# Altium project RSL10.PrjPcb
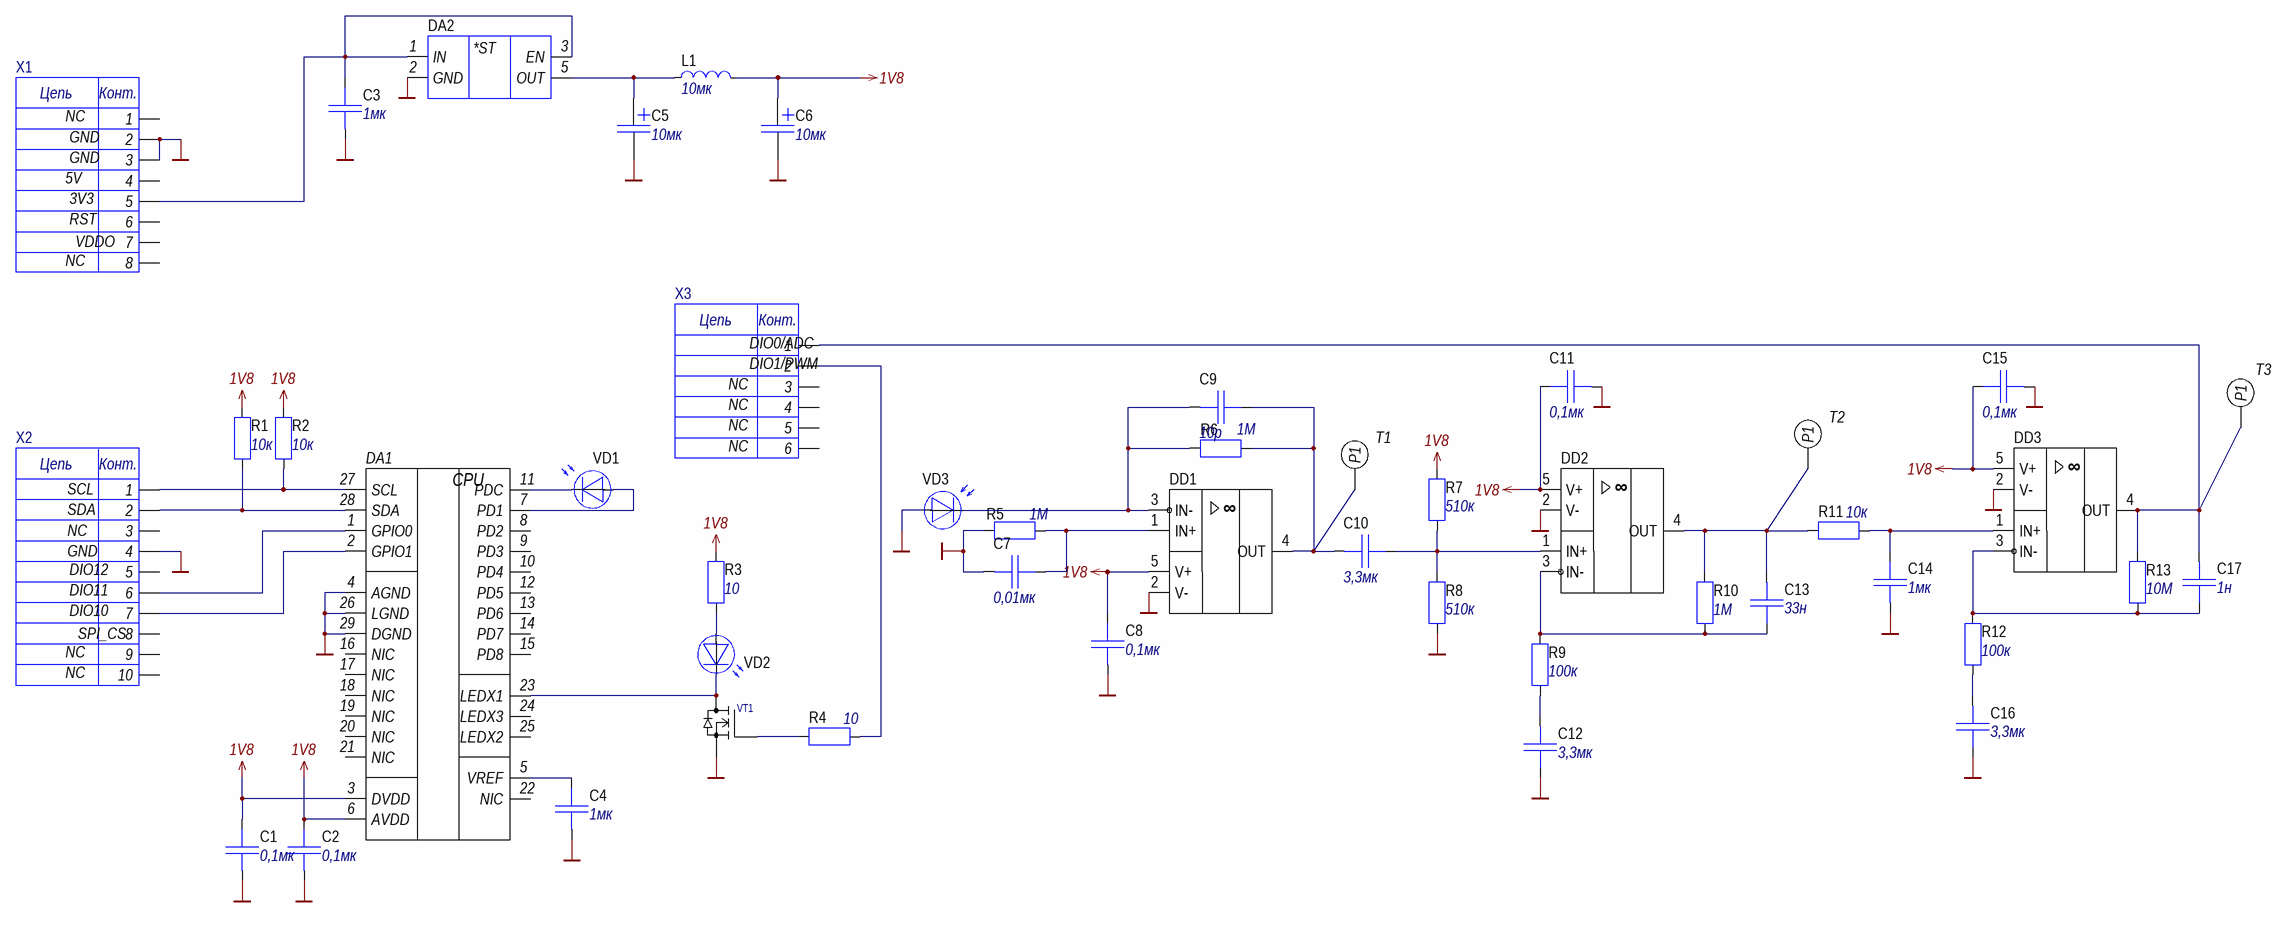
[diagram p0: RSL10_Sch.SchDoc]
2 sheets, 113 parts. Net scope: global (net labels, ports and power ports of the same name join across sheets).
Board file: RSL10_PCB.PcbDoc
Sheets:
  RSL10_Sch.SchDoc
  Course.SchDoc

## Sheet RSL10_Sch.SchDoc
size 594 x 420 mm; CheckedBy: Нестеренко И.В.; Author: Митр Д.В.; SheetNumber: 1; SheetTotal: 2; DevelopedBy: Митр Д.В.

### Parts
C1  0,1мк  [cap0603]
C2  0,1мк  [cap0603]
C3  1мк  [cap0603]
C4  1мк  [cap0603]
C5  10мк
C6  10мк
C7  0,01мк  [cap0603]
C8  0,1мк  [cap0603]
C9  10p  [cap0603]
C10  3,3мк  [cap0603]
C11  0,1мк  [cap0603]
C12  3,3мк  [cap0603]
C13  33н  [cap0603]
C14  1мк  [cap0603]
C15  0,1мк  [cap0603]
C16  3,3мк  [cap0603]
C17  1н  [cap0603]
DA1  ADPD1080  [ADPD1080]  (value not drawn)
DA2  (no value)  [TPS7A02]
DD1  operational amplifier_2  [OPA333]  (value not drawn)
DD2  operational amplifier_1  [OPA333]  (value not drawn)
DD3  operational amplifier_1  [OPA333]  (value not drawn)
L1  10мк  [MLZ1608M100WT000]
R1  10к  [Res0603]
R2  10к  [Res0603]
R3  10  [Res0603]
R4  10  [Res0603]
R5  1M  [Res0603]
R6  1M  [Res0603]
R7  510к  [Res0603]
R8  510к  [Res0603]
R9  100к  [Res0603]
R10  1М  [Res0603]
R11  10к  [Res0603]
R12  100к  [Res0603]
R13  10М  [Res0603]
T1  TestPoint  [TestPoint]  (value not drawn)
T2  TestPoint  [TestPoint]  (value not drawn)
T3  TestPoint  [TestPoint]  (value not drawn)
VD1  (no value)
VD2  (no value)  [LED1206]
VD3  (no value)
VT1  RU1J002YNTCL  [Mosfet]  (value not drawn)
X1  (no value)  [PSL_8]
X2  (no value)  [PSL_10]
X3  (no value)  [PSL_6]

### Nets
1V8: C1.2 C2.2 C6.1 C8.2 C11.2 C15.2 DA1.3(DVDD) DA1.6(AVDD) DD1.5(V+) DD2.5(V+) DD3.5(V+) L1.2 R1.1 R2.1 R3.2 R7.2
GND: C1.1 C2.1 C3.1 C4.1 C5.2 C6.2 C7.1 C8.1 C11.1 C12.2 C14.1 C15.1 C16.2 DA1.4(AGND) DA1.26(LGND) DA1.29(DGND) DA2.2(GND) DD1.2(V-) DD2.2(V-) DD3.2(V-) R5.1 R8.1 VD3.1 VT1.2(S) X1.2 X1.3 X2.4
NetC3_2: C3.2 DA2.1(IN) DA2.3(EN) X1.5
NetC4_2: C4.2 DA1.5(VREF)
NetC5_1: C5.1 DA2.5(OUT) L1.1
NetC7_2: C7.2 DD1.1(IN+) R5.2
NetC9_1: C9.1 DD1.3(IN-) R6.1 VD3.2
NetC9_2: C9.2 C10.1 DD1.4(OUT) R6.2 T1.T(P1)
NetC10_2: C10.2 DD2.1(IN+) R7.1 R8.2
NetC12_1: C12.1 R9.2
NetC13_1: C13.1 DD2.4(OUT) R10.1 R11.2 T2.T(P1)
NetC13_2: C13.2 DD2.3(IN-) R9.1 R10.2
NetC14_2: C14.2 DD3.1(IN+) R11.1
NetC16_1: C16.1 R12.2
NetC17_1: C17.1 DD3.4(OUT) R13.1 T3.T(P1) X3.1
NetC17_2: C17.2 DD3.3(IN-) R12.1 R13.2
NetDA1_1: DA1.1(GPIO0) X2.6
NetDA1_2: DA1.2(GPIO1) X2.7
NetDA1_7: DA1.7(PD1) VD1.1
NetDA1_11: DA1.11(PDC) VD1.2
NetDA1_23: DA1.23(LEDX1) VD2.K VT1.3(D)
NetDA1_27: DA1.27(SCL) R2.2 X2.1
NetDA1_28: DA1.28(SDA) R1.2 X2.2
NetR3_1: R3.1 VD2.A
NetR4_1: R4.1 VT1.1(G)
NetR4_2: R4.2 X3.2

Not connected (* = marked no-connect by the designer): DA1 8(PD2) 9(PD3) 10(PD4) 12(PD5) 13(PD6) 14(PD7) 15(PD8) 16(NIC) 17(NIC) 18(NIC) 19(NIC) 20(NIC) 21(NIC) 22(NIC) 24(LEDX3) 25(LEDX2); X1 1 4 6 7 8; X2 3 5 8 9 10; X3 3 4 5 6

### Notes on the sheet
- Перв. примен.
- Справ. №
- Подп. дата
- Инв. № дубл.
- Взам. инв. №
- Подп. и дата
- Изм.
- Разраб.
- Лист
- № докум.
- Подп.
- Дата
- Лит.
- Масса
- Масштаб
- Пров.
- Т.контр.
- Листов
- Инв. № подл.
- Н.контр.
- Утв.
- ALTIUM GOSTBOM2.0 KEV
- Файл:
- Копировал
- Формат А2
- (in symbol ADPD1080) CPU
- (in symbol LDO) *ST
- (in symbol operational amplifier_1) ∞
- (in symbol operational amplifier_2) ∞
- (in symbol PSL6) Цепь; Конт.; DIO0/ADC; DIO1/PWM; NC
- (in symbol PSL8) Цепь; Конт.; NC; GND; 5V; 3V3; RST; VDDO
- (in symbol PSL10) Цепь; Конт.; SCL; SDA; NC; GND; DIO12; DIO11; DIO10; SPI_CS

### Library data of the parts
C1 = CapCer: Керамический конденсатор; manufacture: ОЖО.460.107ТУ; name_main: CC0603KRX7R7BB104; Units: Ф; Name: Керамический конденсатор; Value: 0,1мк
C2 C8 C11 C15 = CapCer: Керамический конденсатор; manufacture: ОЖО.460.107ТУ; nameSuf: -3; name_main: CC0603KRX7R7BB104; Units: Ф; Name: Керамический конденсатор; Value: 0,1мк
C3 C4 C14 = CapCer: Керамический конденсатор; manufacture: ОЖО.460.107ТУ; nameSuf: -3; name_main: CC0603KRX7R7BB105; Units: Ф; Name: Керамический конденсатор; Value: 1мк
C5 C6 = CapTan: Танталовый конденсатор; manufacture: АЖЯР.673546.004ТУ; name_main: 293D106X9016B2TE3; Units: Ф; Footpr: "E"; Name: Танталовый конденсатор; Value: 10мк
C7 = CapCer: Керамический конденсатор; manufacture: ОЖО.460.107ТУ; name_main: GRM188R71H103K; Units: Ф; Name: Керамический конденсатор; Value: 0,01мк
C9 = CapCer: Керамический конденсатор; manufacture: ОЖО.460.107ТУ; name_main: CL10C100JB8NNNC; Units: Ф; Name: Керамический конденсатор; Value: 10p
C10 C12 C16 = CapCer: Керамический конденсатор; manufacture: ОЖО.460.107ТУ; name_main: GRM21BR60J335K; Units: Ф; Name: Керамический конденсатор; Value: 3,3мк
C13 = CapCer: Керамический конденсатор; manufacture: ОЖО.460.107ТУ; nameSuf: -3; name_main: CC0603KRX7R7BB333; Units: Ф; Name: Керамический конденсатор; Value: 33н
C17 = CapCer: Керамический конденсатор; manufacture: ОЖО.460.107ТУ; name_main: GRM188R61C105K; Units: Ф; Name: Керамический конденсатор; Value: 1н
DA2 = LDO: name: Микросхема; name_main: TPS7A0218PDBVR
DD1 = operational amplifier_2: Операционный усилитель; name_main: OPA333AIDBVR
DD2 DD3 = operational amplifier_1: Операционный усилитель; name_main: OPA333AIDBVR
L1 = Ind: Катушка индуктивности; Units: Гн; Name: Катушка индуктивности; name_main: MLZ1608M100WT000; Value: 10мк
R1 R2 R11 = Res: Резистор; Manufacturer: АЛЯР.434110.005ТУ; Tolerance: 5%; name_main: RC0603FR-0710KL; Name: Резистор; Value: 10к
R3 R4 = Res: Резистор; Tolerance: 5%; name_main: RC0603JR-0710RL; Name: Резистор; Value: 10
R5 R10 = Res: Резистор; Tolerance: 1%; name_main: RC0603FR-071ML; Name: Резистор
  R5: Value: 1M
  R10: Value: 1М
R6 = Res: Резистор; name_main: RC0603FR-071ML; Name: Резистор; Value: 1M
R7 R8 = Res: Резистор; name_main: RC0603FR-07510KL; Name: Резистор; Value: 510к
R9 R12 = Res: Резистор; name_main: RC0603FR-07100KL; Name: Резистор; Value: 100к
R13 = Res: Резистор; name_main: RC0603FR-0710ML; Name: Резистор; Value: 10М
VD1 VD3 = Photodiode: Name: Детектор; Name_main: SFH 2703
VD2 = Led: Излучатель; manufacture: аА0.339.189ТУ; Name: Индикатор; Name_main: 15412094A9000
VT1 = RU1J002YNTCL: N-MOSFET DirectFET SQ
X1 = PSL8: manufacture: БСАР.430420.014ТУ; name: Разъемы; name_main: PLS-8
X2 = PSL10: manufacture: БСАР.430420.014ТУ; name: Разъемы; name_main: PLS-10
X3 = PSL6: manufacture: БСАР.430420.014ТУ; name: Разъемы; name_main: PLS-6

## Sheet Course.SchDoc
size 594 x 420 mm; Author: ALTIUM GOSTBOM2.0 KEV; SheetNumber: 2; SheetTotal: 2
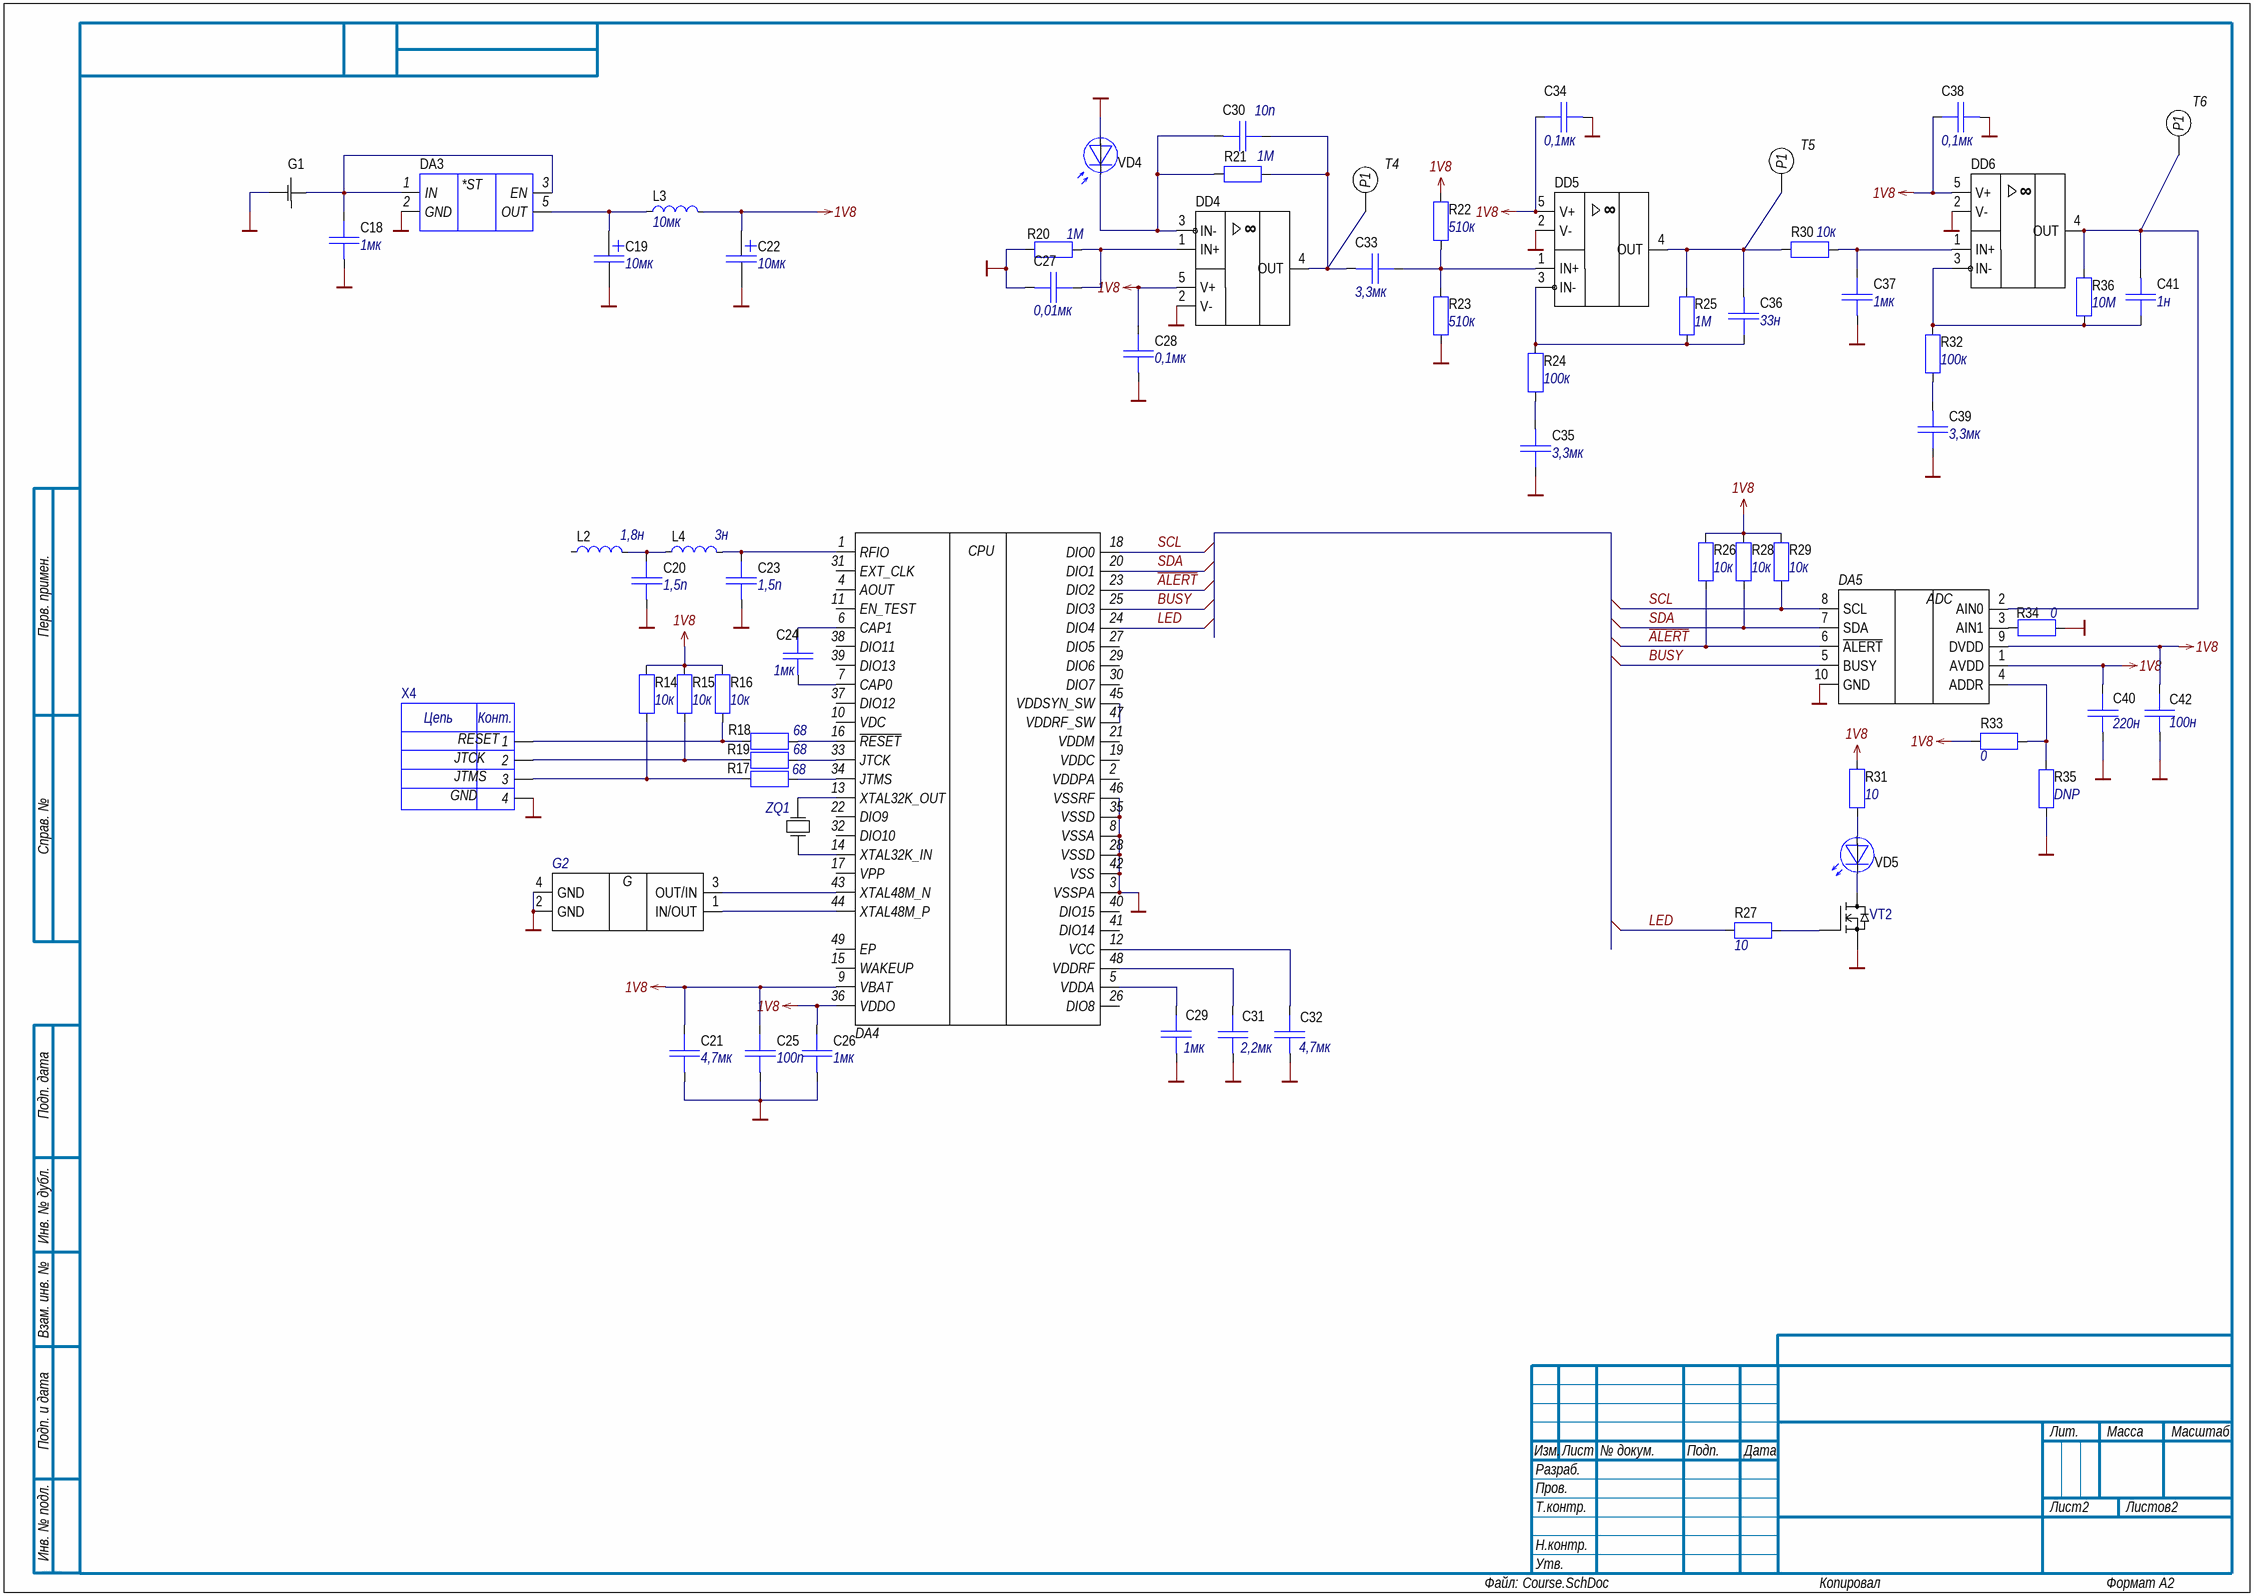
[diagram p1: Course.SchDoc]

### Parts
C18  1мк  [cap0603]
C19  10мк
C20  1,5п  [cap0603]
C21  4,7мк  [CAP0805]
C22  10мк
C23  1,5п  [cap0603]
C24  1мк  [cap0603]
C25  100п  [cap0603]
C26  1мк  [cap0603]
C27  0,01мк  [cap0603]
C28  0,1мк  [cap0603]
C29  1мк  [cap0603]
C30  10п  [cap0603]
C31  2,2мк  [cap0603]
C32  4,7мк  [CAP0805]
C33  3,3мк  [CAP0805]
C34  0,1мк  [cap0603]
C35  3,3мк  [CAP0805]
C36  33н  [cap0603]
C37  1мк  [cap0603]
C38  0,1мк  [cap0603]
C39  3,3мк  [CAP0805]
C40  220н  [cap0603]
C41  1н  [cap0603]
C42  100н  [cap0603]
DA3  (no value)  [TPS7A02]
DA4  RSL10  [RSL10]  (value not drawn)
DA5  ADC  [ADS7142IRUGT]  (value not drawn)
DD4  operational amplifier_2  [OPA333]  (value not drawn)
DD5  operational amplifier_1  [OPA333]  (value not drawn)
DD6  operational amplifier_1  [OPA333]  (value not drawn)
G1  battery  (value not drawn)
G2  Обозначение при заказе  [XTAL48]  (value not drawn)
L2  1,8н  [IND0402]
L3  10мк  [MLZ1608M100WT000]
L4  3н  [IND0402]
R14  10к  [Res0603]
R15  10к  [Res0603]
R16  10к  [Res0603]
R17  68  [Res0603]
R18  68  [Res0603]
R19  68  [Res0603]
R20  1M  [Res0603]
R21  1M  [Res0603]
R22  510к  [Res0603]
R23  510к  [Res0603]
R24  100к  [Res0603]
R25  1М  [Res0603]
R26  10к  [Res0603]
R27  10  [Res0603]
R28  10к  [Res0603]
R29  10к  [Res0603]
R30  10к  [Res0603]
R31  10  [Res0603]
R32  100к  [Res0603]
R33  0  [Res0603]
R34  0  [Res0603]
R35  DNP  [Res0603]  (no BOM)
R36  10М  [Res0603]
T4  TestPoint  [TestPoint]  (value not drawn)
T5  TestPoint  [TestPoint]  (value not drawn)
T6  TestPoint  [TestPoint]  (value not drawn)
VD4  (no value)
VD5  (no value)  [LED1206]
VT2  RU1J002YNTCL  [Mosfet]  (value not drawn)
X4  (no value)  [PSL_4]
ZQ1  Обозначение при заказе  [XTAL32]  (value not drawn)

### Nets
1V8: C21.2 C22.1 C25.2 C26.2 C28.2 C34.2 C38.2 C40.2 C42.2 DA4.9(VBAT) DA4.36(VDDO) DA5.1(AVDD) DA5.9(DVDD) DD4.5(V+) DD5.5(V+) DD6.5(V+) L3.2 R14.1 R15.1 R16.1 R22.2 R26.1 R28.1 R29.1 R31.2 R33.1
GND: C18.1 C19.2 C20.1 C21.1 C22.2 C23.1 C25.1 C26.1 C27.1 C28.1 C29.1 C31.1 C32.1 C34.1 C35.2 C37.1 C38.1 C39.2 C40.1 C42.1 DA3.2(GND) DA4.3(VSSPA) DA4.8(VSSA) DA4.28(VSSD) DA4.35(VSSD) DA4.42(VSS) DA4.46(VSSRF) DA5.10(GND) DD4.2(V-) DD5.2(V-) DD6.2(V-) G1.- G2.2(GND) G2.4(GND) R20.1 R23.1 R34.2 R35.2 VD4.1 VT2.2(S) X4.4
~{ALERT}: DA4.23(DIO2) DA5.6(~{ALERT}) R26.2
BUSY: DA4.25(DIO3) DA5.5(BUSY)
LED: DA4.24(DIO4) R27.2
SCL: DA4.18(DIO0) DA5.8(SCL) R29.2
SDA: DA4.20(DIO1) DA5.7(SDA) R28.2
NetC18_2: C18.2 DA3.1(IN) DA3.3(EN) G1.+
NetC19_1: C19.1 DA3.5(OUT) L3.1
NetC20_2: C20.2 L2.2 L4.1
NetC23_2: C23.2 DA4.1(RFIO) L4.2
NetC24_1: C24.1 DA4.7(CAP0)
NetC24_2: C24.2 DA4.6(CAP1)
NetC27_2: C27.2 DD4.1(IN+) R20.2
NetC29_2: C29.2 DA4.5(VDDA)
NetC30_1: C30.1 DD4.3(IN-) R21.1 VD4.2
NetC30_2: C30.2 C33.1 DD4.4(OUT) R21.2 T4.T(P1)
NetC31_2: C31.2 DA4.48(VDDRF)
NetC32_2: C32.2 DA4.12(VCC)
NetC33_2: C33.2 DD5.1(IN+) R22.1 R23.2
NetC35_1: C35.1 R24.2
NetC36_1: C36.1 DD5.4(OUT) R25.1 R30.2 T5.T(P1)
NetC36_2: C36.2 DD5.3(IN-) R24.1 R25.2
NetC37_2: C37.2 DD6.1(IN+) R30.1
NetC39_1: C39.1 R32.2
NetC41_1: C41.1 DA5.2(AIN0) DD6.4(OUT) R36.1 T6.T(P1)
NetC41_2: C41.2 DD6.3(IN-) R32.1 R36.2
NetDA4_13: DA4.13(XTAL32K_OUT) ZQ1.2
NetDA4_14: DA4.14(XTAL32K_IN) ZQ1.1
NetDA4_16: DA4.16(~{RESET}) R18.1
NetDA4_33: DA4.33(JTCK) R19.1
NetDA4_34: DA4.34(JTMS) R17.1
NetDA4_43: DA4.43(XTAL48M_N) G2.3(OUT/IN)
NetDA4_44: DA4.44(XTAL48M_P) G2.1(IN/OUT)
NetDA4_45: DA4.45(VDDSYN_SW) DA4.47(VDDRF_SW)
NetDA5_3: DA5.3(AIN1) R34.1
NetDA5_4: DA5.4(ADDR) R33.2 R35.1
NetR14_2: R14.2 R17.2 X4.3
NetR15_2: R15.2 R19.2 X4.2
NetR16_2: R16.2 R18.2 X4.1
NetR27_1: R27.1 VT2.1(G)
NetR31_1: R31.1 VD5.A
NetVD5_K: VD5.K VT2.3(D)

Not connected (* = marked no-connect by the designer): DA4 2(VDDPA) 4(AOUT) 10(VDC) 11(EN_TEST) 15(WAKEUP) 17(VPP) 19(VDDC) 21(VDDM) 22(DIO9) 26(DIO8) 27(DIO5) 29(DIO6) 30(DIO7) 31(EXT_CLK) 32(DIO10) 37(DIO12) 38(DIO11) 39(DIO13) 40(DIO15) 41(DIO14) 49(EP); L2 1

### Notes on the sheet
- Перв. примен.
- Справ. №
- Подп. дата
- Инв. № дубл.
- Взам. инв. №
- Подп. и дата
- Изм.
- Разраб.
- Лист
- № докум.
- Подп.
- Дата
- Лит.
- Масса
- Масштаб
- Пров.
- Т.контр.
- Листов
- Инв. № подл.
- Н.контр.
- Утв.
- ALTIUM GOSTBOM2.0 KEV
- Файл:
- Копировал
- Формат А2
- (in symbol LDO) *ST
- (in symbol operational amplifier_1) ∞
- (in symbol operational amplifier_2) ∞
- (in symbol PSL4) Цепь; Конт.; RESET; JTCK; JTMS; GND
- (in symbol RSL10) CPU
- (in symbol XTAL48) G

### Library data of the parts
C18 C24 C26 C29 C37 = CapCer: as C3 on sheet RSL10_Sch; Name: Керамический конденсатор; Value: 1мк
C19 C22 = CapTan: as C5 on sheet RSL10_Sch; Name: Танталовый конденсатор; Value: 10мк
C20 C23 = CapCer: Керамический конденсатор; manufacture: ОЖО.460.107ТУ; name_main: CL10C1R5CB8NNNC; Units: Ф; Name: Керамический конденсатор; Value: 1,5п
C21 C32 C33 C35 C39 = CapCer: as C10 on sheet RSL10_Sch; Name: Керамический конденсатор
  C21 C32: Value: 4,7мк
  C33 C35 C39: Value: 3,3мк
C25 = CapCer: Керамический конденсатор; manufacture: ОЖО.460.107ТУ; name_main: GRM1885C1H101J; Units: Ф; Name: Керамический конденсатор; Value: 100п
C27 = CapCer: as C7 on sheet RSL10_Sch; Name: Керамический конденсатор; Value: 0,01мк
C28 C34 C38 = CapCer: as C2 on sheet RSL10_Sch; Name: Керамический конденсатор; Value: 0,1мк
C30 = CapCer: as C9 on sheet RSL10_Sch; Name: Керамический конденсатор; Value: 10п
C31 = CapCer: Керамический конденсатор; manufacture: ОЖО.460.107ТУ; name_main: GRM188R61A225K; Units: Ф; Name: Керамический конденсатор; Value: 2,2мк
C36 = CapCer: as C13 on sheet RSL10_Sch; Name: Керамический конденсатор; Value: 33н
C40 = CapCer: Керамический конденсатор; manufacture: ОЖО.460.107ТУ; name_main: CL10B224KA8NNNC; Units: Ф; Name: Керамический конденсатор; Value: 220н
C41 = CapCer: as C17 on sheet RSL10_Sch; Name: Керамический конденсатор; Value: 1н
C42 = CapCer: Керамический конденсатор; manufacture: ОЖО.460.107ТУ; name_main: GRM188R71C104KA01D; Units: Ф; Name: Керамический конденсатор; Value: 100н
DA3 = LDO: as DA2 on sheet RSL10_Sch
DD4 = operational amplifier_2: as DD1 on sheet RSL10_Sch
DD5 DD6 = operational amplifier_1: as DD2 on sheet RSL10_Sch
G2 = XTAL48: ECS-480-8-47-JTN-TR
L2 = Ind: Катушка индуктивности; Units: Гн; name_main: LQG15HS1N8S02D; Name: Катушка индуктивности; Value: 1,8н
L3 = Ind: Катушка индуктивности; Units: Гн; Name: Катушка индуктивности; name_main: MLZ1608M100WT000; Value: 10мк
L4 = Ind: Катушка индуктивности; Units: Гн; name_main: LQG15HS3N0S02D; Name: Катушка индуктивности; Value: 3н
R14-R16 R26 R28-R30 = Res: as R1 on sheet RSL10_Sch; Name: Резистор; Value: 10к
R17-R19 = Res: Резистор; name_main: AC0603FR-0768RL; Name: Резистор; Value: 68
R20 R25 = Res: as R5 on sheet RSL10_Sch; Name: Резистор
  R20: Value: 1M
  R25: Value: 1М
R21 = Res: Резистор; name_main: RC0603FR-071ML; Name: Резистор; Value: 1M
R22 R23 = Res: Резистор; name_main: RC0603FR-07510KL; Name: Резистор; Value: 510к
R24 R32 = Res: Резистор; name_main: RC0603FR-07100KL; Name: Резистор; Value: 100к
R27 R31 = Res: as R3 on sheet RSL10_Sch; Name: Резистор; Value: 10
R33 R34 = Res: Резистор; Manufacturer: АЛЯР.434110.005ТУ; Tolerance: 5%; name_main: RC0603FR-070RL; Name: Резистор; Value: 0
R35 = Res: Резистор; Manufacturer: АЛЯР.434110.005ТУ; Tolerance: 5%; name_main: Р1-12-0,1-; Name: Резистор; Value: DNP
R36 = Res: Резистор; name_main: RC0603FR-0710ML; Name: Резистор; Value: 10М
VD4 = Photodiode: Name: Детектор; Name_main: SFH 2703
VD5 = Led: as VD2 on sheet RSL10_Sch
VT2 = RU1J002YNTCL: N-MOSFET DirectFET SQ
X4 = PSL4: manufacture: БСАР.430420.014ТУ; name: Разъемы; name_main: PLS-6
ZQ1 = XTAL32.768: FC-135 32.7680KA-AG0

## Nets that join several sheets
1V8: RSL10_Sch (16 pins), Course (26 pins)
GND: RSL10_Sch (27 pins), Course (41 pins)